# Altium schematic sheet P[13]BOOT_CFG.SchDoc
size 513 x 386 mm
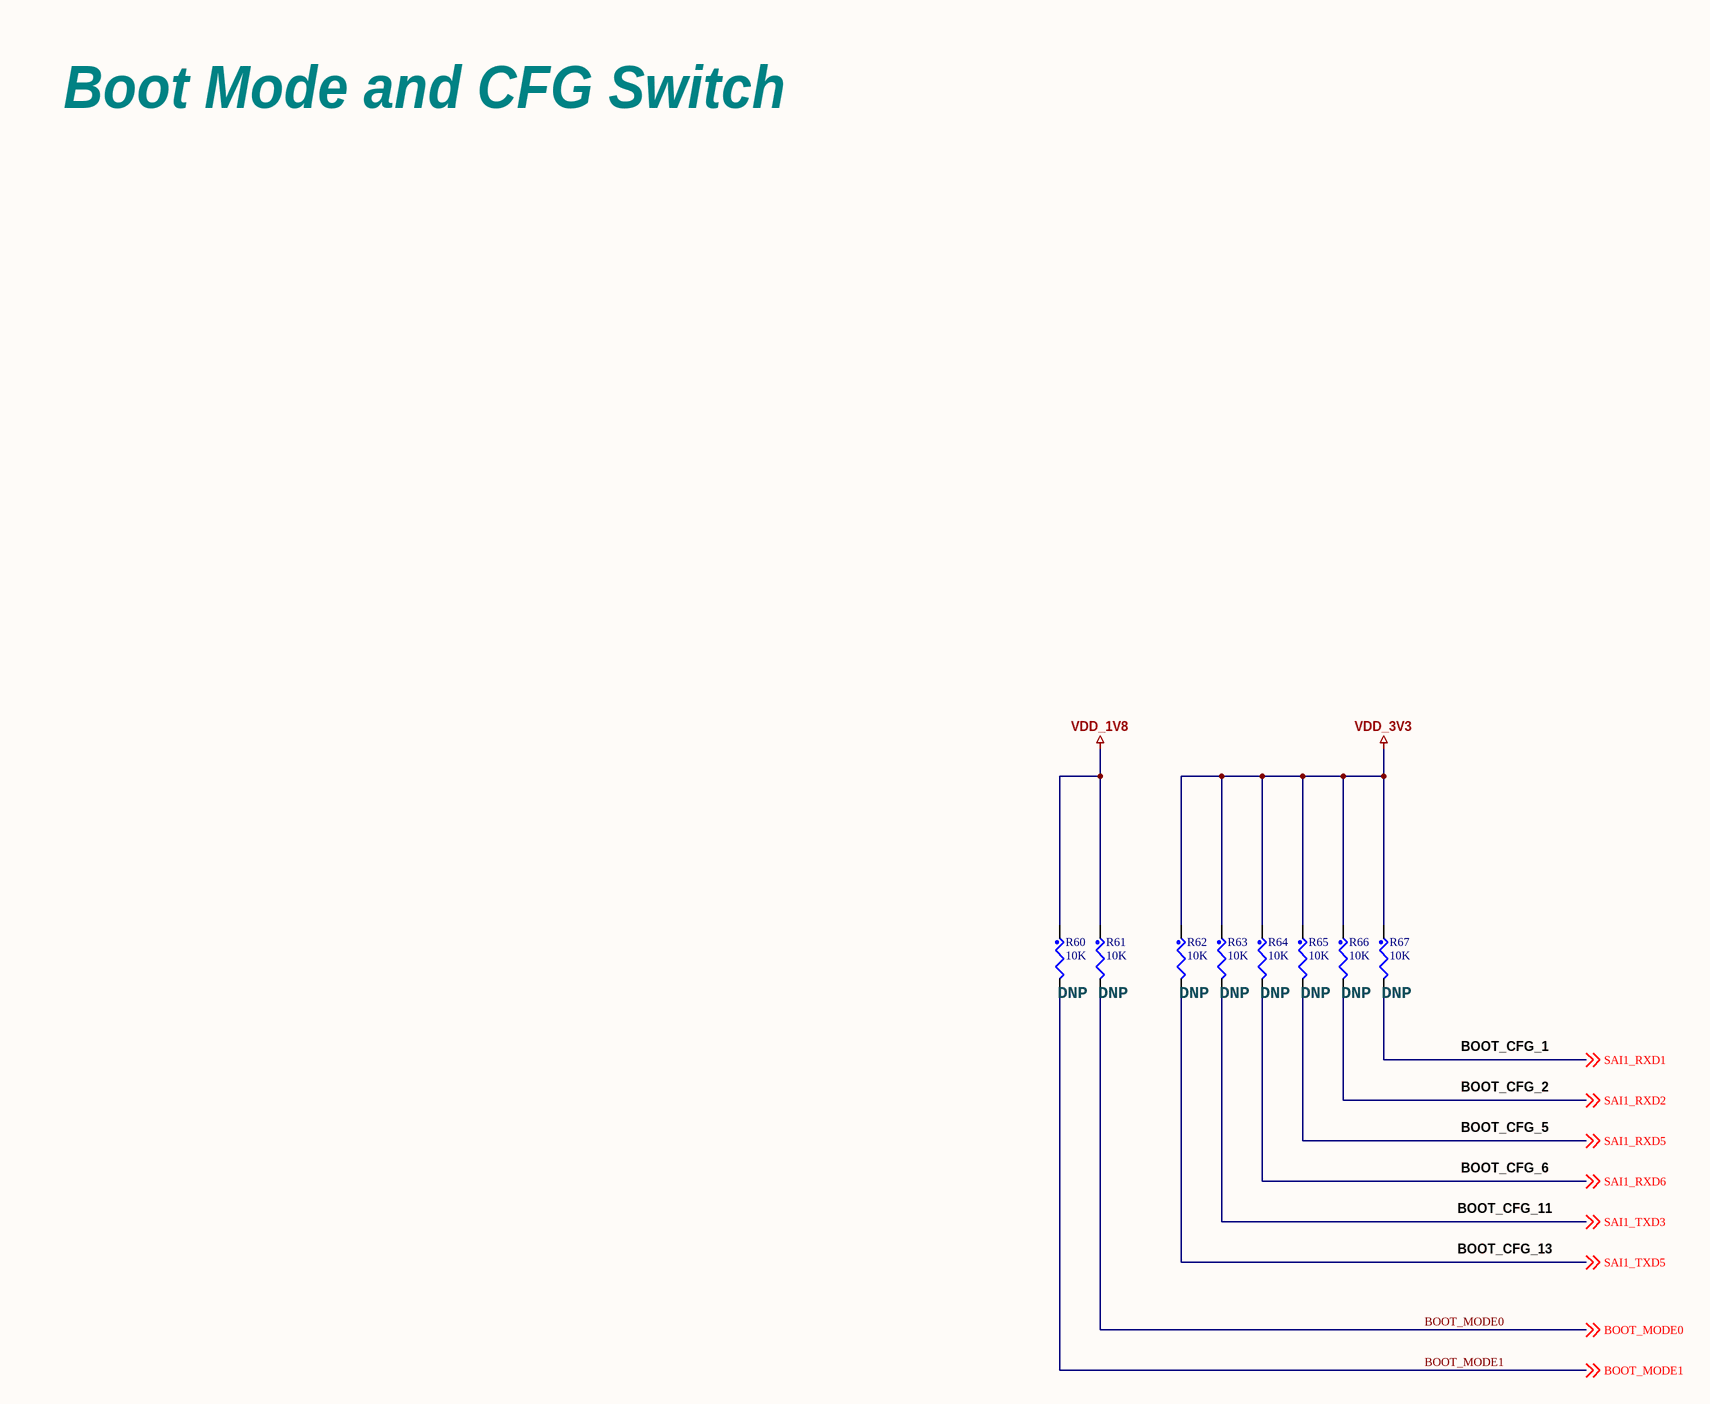
[diagram p0: P[13]BOOT_CFG.SchDoc]

## Parts
R60  10K  [0402_CC]
R61  10K  [0402_CC]
R62  10K  [0402_CC]
R63  10K  [0402_CC]
R64  10K  [0402_CC]
R65  10K  [0402_CC]
R66  10K  [0402_CC]
R67  10K  [0402_CC]

## Nets
VDD_1V8: R60.1 R61.1
VDD_3V3: R62.1 R63.1 R64.1 R65.1 R66.1 R67.1
BOOT_MODE0: R61.2 ; off-sheet BOOT_MODE0
BOOT_MODE1: R60.2 ; off-sheet BOOT_MODE1
SAI1_RXD1: R67.2 ; off-sheet SAI1_RXD1
SAI1_RXD2: R66.2 ; off-sheet SAI1_RXD2
SAI1_RXD5: R65.2 ; off-sheet SAI1_RXD5
SAI1_RXD6: R64.2 ; off-sheet SAI1_RXD6
SAI1_TXD3: R63.2 ; off-sheet SAI1_TXD3
SAI1_TXD5: R62.2 ; off-sheet SAI1_TXD5

## Notes on the sheet
- Boot Mode and CFG Switch
- (near R60) DNP
- (near R61) DNP
- (near R62) DNP
- (near R63) DNP
- (near R64) DNP
- (near R65) DNP
- (near R66) DNP
- (near R67) DNP
- BOOT_CFG_1
- BOOT_CFG_2
- BOOT_CFG_5
- BOOT_CFG_6
- BOOT_CFG_11
- BOOT_CFG_13

## Library data of the parts
R60-R67 = RES: CLASS: DISCRETE